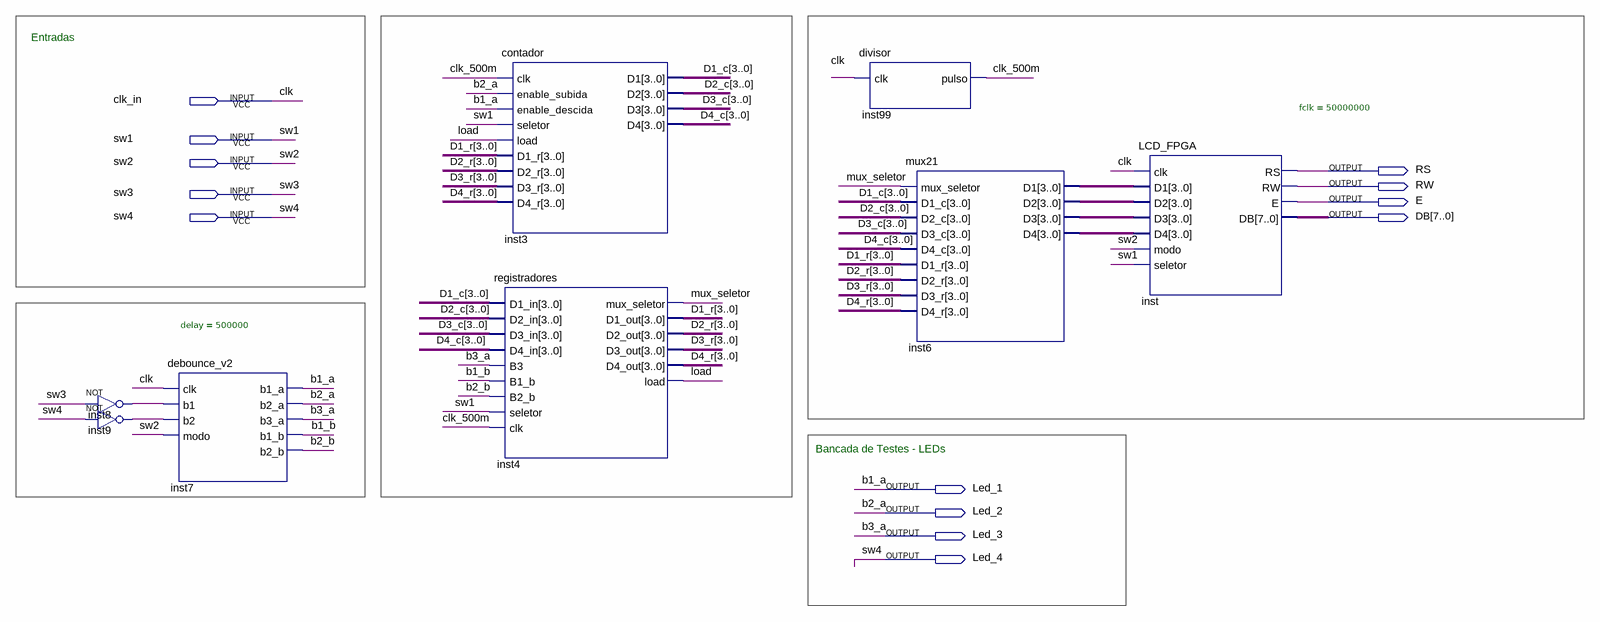
[diagram p0: schematic sheet]
// Quartus schematic proj3_blocos.bdf as structural Verilog: 8 symbols, 13 pins
module proj3_blocos (
  input  clk_in,
  input  sw1,
  input  sw2,
  input  sw3,
  input  sw4,
  output RS,
  output RW,
  output E,
  output [7:0] DB,
  output Led_1,
  output Led_2,
  output Led_3,
  output Led_4
);

  wire b1_b, b2_b, clk_500m, inst8_out, inst9_out, load, mux_seletor;
  wire [3:0] D1_c, D1_r, D2_c, D2_r, D3_c, D3_r, D4_c, D4_r, inst6_d1, inst6_d2, inst6_d3, inst6_d4;

  not inst8 (inst8_out, sw3);
  not inst9 (inst9_out, sw4);
  debounce_v2 #(.delay(500000)) inst7 (
    .clk(clk_in), .b1(inst8_out), .b2(inst9_out), .modo(sw2), .b1_a(Led_1), .b2_a(Led_2), .b3_a(Led_3),
    .b1_b(b1_b), .b2_b(b2_b));
  contador inst3 (
    .clk(clk_500m), .enable_subida(Led_2), .enable_descida(Led_1), .seletor(sw1), .load(load), .D1_r(D1_r),
    .D2_r(D2_r), .D3_r(D3_r), .D4_r(D4_r), .D1(D1_c), .D2(D2_c), .D3(D3_c), .D4(D4_c));
  registradores inst4 (
    .D1_in(D1_c), .D2_in(D2_c), .D3_in(D3_c), .D4_in(D4_c), .B3(Led_3), .B1_b(b1_b), .B2_b(b2_b),
    .seletor(sw1), .clk(clk_500m), .mux_seletor(mux_seletor), .D1_out(D1_r), .D2_out(D2_r), .D3_out(D3_r),
    .D4_out(D4_r), .load(load));
  divisor inst99 (.clk(clk_in), .pulso(clk_500m));
  mux21 inst6 (
    .mux_seletor(mux_seletor), .D1_c(D1_c), .D2_c(D2_c), .D3_c(D3_c), .D4_c(D4_c), .D1_r(D1_r), .D2_r(D2_r),
    .D3_r(D3_r), .D4_r(D4_r), .D1(inst6_d1), .D2(inst6_d2), .D3(inst6_d3), .D4(inst6_d4));
  LCD_FPGA #(.fclk(50000000)) inst (
    .clk(clk_in), .D1(inst6_d1), .D2(inst6_d2), .D3(inst6_d3), .D4(inst6_d4), .modo(sw2), .seletor(sw1),
    .RS(RS), .RW(RW), .E(E), .DB(DB));

  assign Led_4 = sw4;

  // Other names for the same wires on the sheet: b1_a = Led_1; b2_a = Led_2; b3_a = Led_3; clk = clk_in

  // Notes on the sheet:
  //   Entradas
  //   Bancada de Testes - LEDs
endmodule
